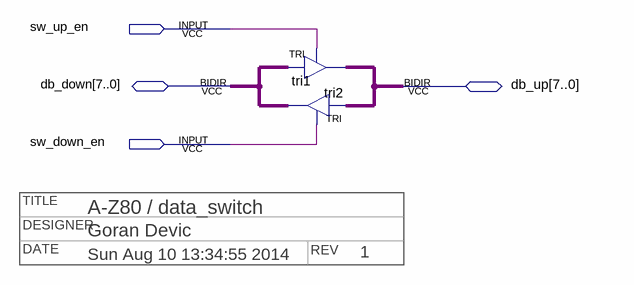
[diagram p0: schematic sheet]
// Quartus schematic data_switch.bdf as structural Verilog: 2 symbols, 4 pins
// Title block: TITLE: A-Z80 / data_switch; DESIGNER: Goran Devic; DATE: Sun Aug 10 13:34:55 2014; REV: 1
module data_switch (
  input  sw_up_en,
  input  sw_down_en,
  inout  [7:0] db_down,
  inout  [7:0] db_up
);

  TRI \tri1 [7:0] (.IN(db_down), .OE(sw_up_en), .OUT(db_up));
  TRI tri2[7:0] (.IN(db_up), .OE(sw_down_en), .OUT(db_down));
endmodule
